# EasyEDA Pro project uicd.eprj, board PCB2
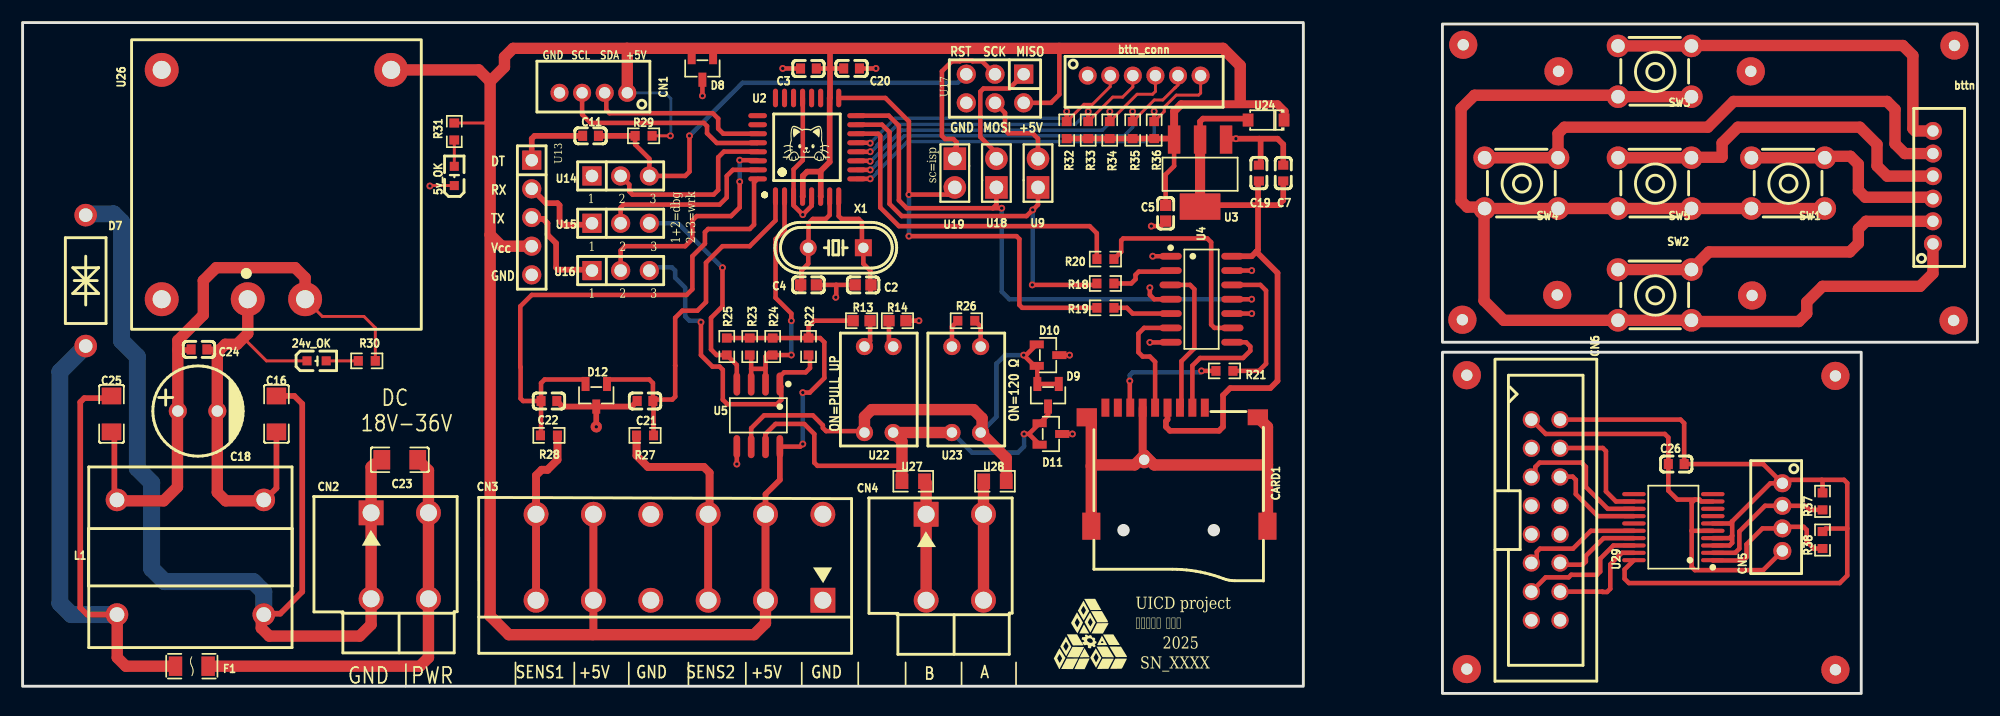
[diagram p3: board, top side]
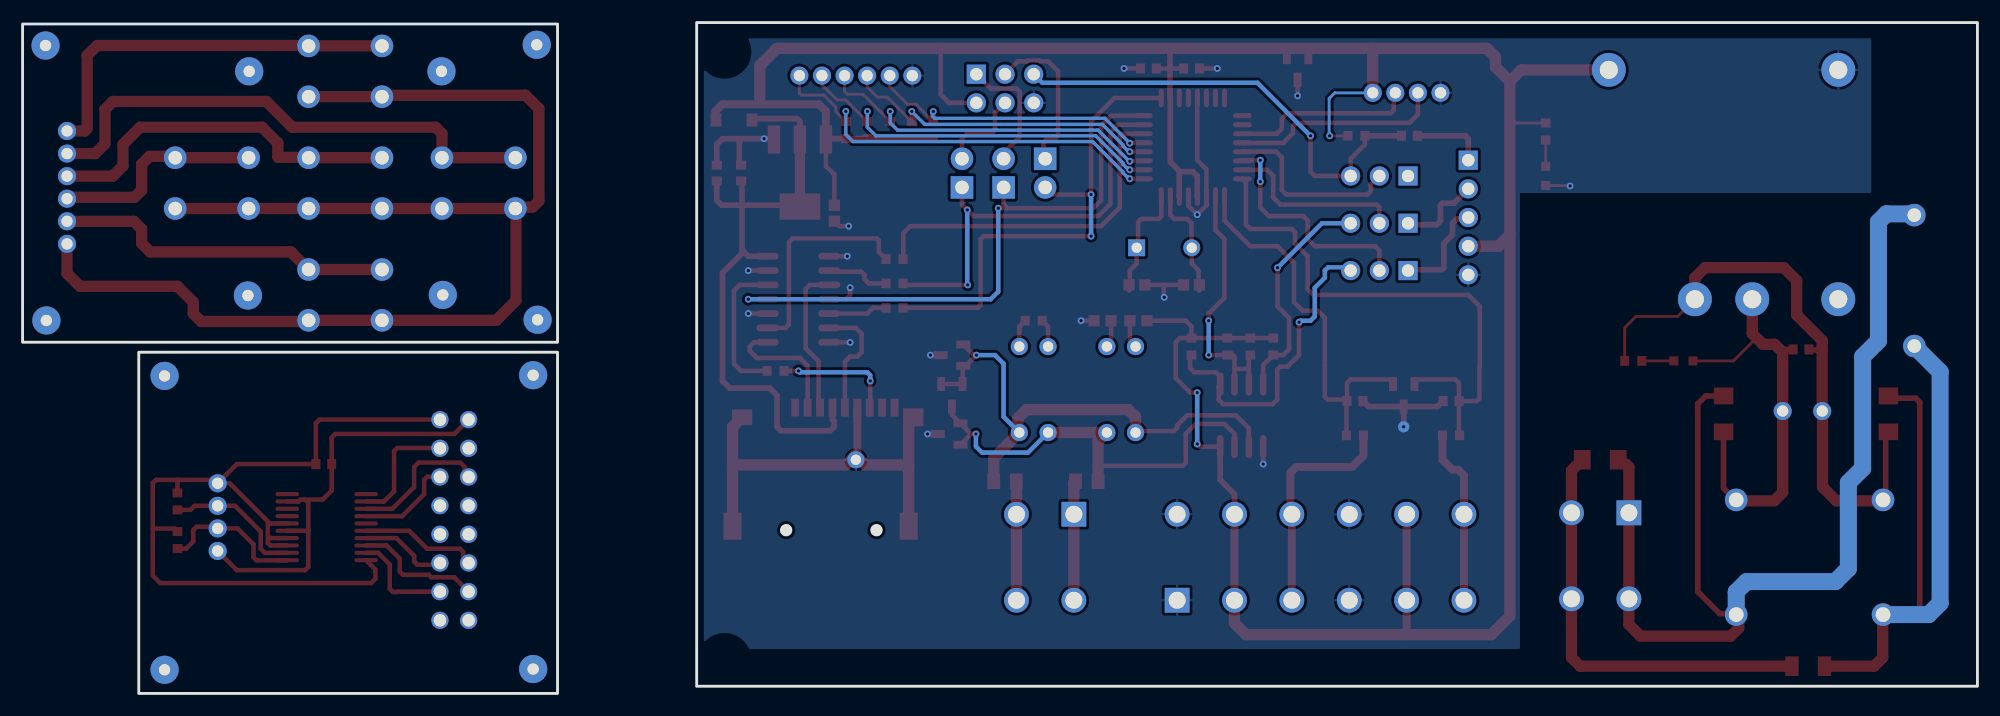
[diagram p4: board, bottom side, seen from below]

Outline 173.1 x 59.44 mm; copper layers: Top Layer, Bottom Layer. Coordinates in mm from the lower left corner of the outline.
Outline path: rectangle 0,59.44 113.41,0.63 ; rectangle 162.81,0 125.73,30.23 ; rectangle 173.1,31.12 125.73,59.31
Stack: Top Layer 0.035mm / Dielectric1 1.51mm FR4 er 4.5 / Bottom Layer 0.035mm

## Design rules (mm)
template: Custom Config
spacing copperThickness1oz (default): track to track 0.102, other pairs 0.152 to 0.3
spacing copperThickness2oz: track to track 0.203, other pairs 0.152 to 0.3
track width copperThickness1oz (default): min 0.127, default 0.4, max 2.54
track width copperThickness2oz: min 0.203, default 0.4, max 2.54
differential pair differentialPair (default): width min 0.127, default 0.254, max 2.54; gap min 0.152, default 0.152
via viaSize (default): diameter min 0.5, default 0.61, max 10; hole min 0.3, default 0.305, max 6.3

## Placement (name value [footprint] x y rotation side)
5v_OK  EL0603/G6C-A01/DT(TS)(GW)  [LED0603-R-RD_GREEN]  38.23 45.85 90 top
24v_OK  EL0603/G6C-A01/DT(TS)(GW)  [LED0603-R-RD_GREEN]  26.04 29.46 0 top
bttn  B6B-PH-K-S(LF)(SN)  [CONN-TH_B6B-PH-K-S]  169.16 44.83 270 top
bttn_conn  B6B-PH-K-S(LF)(SN)  [CONN-TH_B6B-PH-K-S]  99.31 54.74 180 top
C2  22pF  [C0603#2]  74.42 36.2 180 top
C3  100nF  [C0603]  69.59 55.36 0 top
C4  22pF  [C0603#2]  69.6 36.2 0 top
C5  100nF  [C0603#2]  101.22 42.55 90 top
C7  100nF  [C0603]  111.63 46.1 270 top
C11  100nF  [C0603]  50.29 49.4 0 top
C16  1nF  [C1206]  22.48 24.77 90 top
C18  100uF  [CAP-TH_BD8.0-P3.50-D0.5-FD]  15.49 25.02 0 top
C19  10uF  [C0603]  109.47 46.1 90 top
C20  10uF  [C0603]  73.41 55.37 180 top
C21  10nF  [C0603]  55.12 25.91 0 top
C22  10nF  [C0603]  46.61 25.91 180 top
C23  4.7uF  [C1206]  33.4 20.7 0 top
C24  100nF  [C0603]  15.62 30.48 180 top
C25  1nF  [C1206]  7.87 24.77 90 top
C26  100nF  [C0603]  146.43 20.32 0 top
CARD1  TF-15x15  [TF-SMD_TF-15-15]  102.24 20.07 270 top
CN1  B4B-PH-K-S(LF)(SN)  [CONN-TH_B4B-PH-K-S]  50.55 53.21 0 top
CN2  KF142V-5.08-2P  [CONN-TH_P5.08_KF142V-5.08-2P]  33.4 12.19 0 top
CN3  KF142V-5.08-6P  [CONN-TH_6P-P5.08_KF142V-5.08-6P]  58.17 12.07 0 top
CN4  KF142V-5.08-2P  [CONN-TH_P5.08_KF142V-5.08-2P]  82.55 12.07 0 top
CN5  B4B-PH-K-S(LF)(SN)  [CONN-TH_B4B-PH-K-S]  155.83 15.62 90 top
CN6  DS1013-16SSiB1-B-0  [IDC-TH_16P-P2.54_C3406]  134.87 15.37 270 top
D7  P6KE33CA  [DO-15_BD3.1-L6.7-P10.70-D0.9-BI]  5.59 36.58 270 top
D8  PESD5V0S2BT  [SOT-23-3_L2.9-W1.3-P1.90-LS2.4-BR]  60.2 55.37 90 top
D9  PESD5V0S2BT  [SOT-23-3_L2.9-W1.3-P1.90-LS2.4-BR]  90.81 26.42 90 top
D10  PESD5V0S2BT  [SOT-23-3_L2.9-W1.3-P1.90-LS2.4-BR]  90.81 29.97 180 top
D11  PESD5V0S2BT  [SOT-23-3_L2.9-W1.3-P1.90-LS2.4-BR]  91.06 22.99 180 top
D12  PESD5V0S2BT  [SOT-23-3_L2.9-W1.3-P1.90-LS2.4-BR]  50.8 26.42 90 top
F1  1206L200/24NR  [F1206]  14.99 2.41 180 top
L1  PLA10AS1030R7R2B  [FILTER-TH_PLA10AS1030R7R2B]  14.86 12.07 0 top
NOREF  -  [Pad_e684]  171.07 57.4 180 top
NOREF#2  -  [Pad_e732]  153.15 35.26 180 top
NOREF#3  -  [Pad_e731]  135.89 35.31 180 top
NOREF#4  -  [Pad_e899]  127.89 2.16 180 top
NOREF#5  -  [Pad_e733]  153.03 55.12 180 top
NOREF#6  -  [Pad_e737]  136.01 55.12 180 top
NOREF#7  -  [Pad_e900]  160.53 2.1 180 top
NOREF#8  -  [Pad_e716]  170.99 33.04 180 top
NOREF#9  -  [Pad_e898]  127.89 28.19 180 top
NOREF#10  -  [Pad_e552]  99.31 20.7 0 top
NOREF#11  -  [Pad_e687]  127.57 57.47 180 top
NOREF#12  -  [Pad_e720]  127.5 33.11 180 top
NOREF#13  -  [Pad_e906]  160.53 28.13 180 top
R13  560Ω  [R0603#2]  74.3 33.02 0 top
R14  560Ω  [R0603#2]  77.47 33.02 0 top
R18  3.3kΩ  [R0603]  95.89 36.32 0 top
R19  3.3kΩ  [R0603]  95.89 34.16 0 top
R20  3.3kΩ  [R0603]  95.89 38.48 0 top
R21  3.3kΩ  [R0603]  106.43 28.58 180 top
R22  10kΩ  [R0603]  69.6 30.73 90 top
R23  10kΩ  [R0603]  64.39 30.73 90 top
R24  10kΩ  [R0603]  66.42 30.73 90 top
R25  10kΩ  [R0603]  62.36 30.73 90 top
R26  120Ω  [R0603]  83.57 33.02 180 top
R27  10kΩ  [R0603]  55.12 22.86 180 top
R28  10kΩ  [R0603]  46.61 22.86 180 top
R29  10kΩ  [R0603]  54.99 49.4 0 top
R30  10kΩ  [R0603]  30.48 29.46 180 top
R31  4k7  [R0603]  38.23 49.78 270 top
R32  10kΩ  [R0603]  92.46 49.91 270 top
R33  10kΩ  [R0603]  94.36 49.91 270 top
R34  10kΩ  [R0603]  96.27 49.91 270 top
R35  10kΩ  [R0603]  98.3 49.91 270 top
R36  10kΩ  [R0603]  100.2 49.91 270 top
R37  3.3kΩ  [R0603]  159.39 17.02 90 top
R38  3.3kΩ  [R0603]  159.39 13.59 90 top
SW1  1-1825910-4  [KEY-TH_4P-L6.0-W6.0-P4.50-LS7.5]  156.34 45.21 180 top
SW2  1-1825910-4  [KEY-TH_4P-L6.0-W6.0-P4.50-LS7.5]  144.53 35.31 180 top
SW3  1-1825910-4  [KEY-TH_4P-L6.0-W6.0-P4.50-LS7.5]  144.53 55.12 180 top
SW4  1-1825910-4  [KEY-TH_4P-L6.0-W6.0-P4.50-LS7.5]  132.72 45.21 180 top
SW5  1-1825910-4  [KEY-TH_4P-L6.0-W6.0-P4.50-LS7.5]  144.53 45.21 180 top
U2  ATMEGA328-AU  [TQFP-32_L7.0-W7.0-P0.80-LS9.0-BL]  69.47 48.39 0 top
U3  AMS1117-3.3  [SOT-223-3_L6.5-W3.4-P2.30-LS7.0-BR-1]  104.27 46.1 90 top
U4  AIP74HC125  [SOP-14_L8.6-W3.9-P1.27-LS6.0-BL]  104.39 34.93 270 top
U5  MAX485CSA+  [SOIC-8_L4.9-W3.9-P1.27-LS6.0-BL]  65.15 24.64 180 top
U9  DS1021-1x2SF11-B  [HDR-TH_2P-P2.54-V-M]  89.92 46.1 90 top
U13  DS1021-1x5SF11-B  [HDR-TH_5P-P2.54-V-M]  45.09 42.16 270 top
U14  DS1021-1x3SF11-B  [HDR-TH_3P-P2.54-V-M]  52.96 45.85 0 top
U15  DS1021-1x3SF11-B  [HDR-TH_3P-P2.54-V-M]  52.96 41.66 0 top
U16  DS1021-1x3SF11-B  [HDR-TH_3P-P2.54-V-M]  52.96 37.47 0 top
U17  DS1021-2x3SF11-B  [HDR-TH_6P-P2.54-V-M-R2-C3-S2.54]  86.11 53.59 180 top
U18  DS1021-1x2SF11-B  [HDR-TH_2P-P2.54-V-M]  86.23 46.1 90 top
U19  DS1021-1x2SF11-B  [HDR-TH_2P-P2.54-V-M]  82.55 46.1 270 top
U22  SMQS-02R-TP  [SW-TH_4P-L9.9-W6.8-P7.62-BL]  75.82 26.92 180 top
U23  SMQS-02R-TP  [SW-TH_4P-L9.9-W6.8-P7.62-BL]  83.57 26.92 0 top
U24  BAT46W  [SOD-123_L2.8-W1.6-LS3.7-RD]  110.11 50.8 180 top
U26  URB2405YMD-10WR3  [PWRM-TH_HI-LINK_URXXYMD-XXWR3]  22.48 45.09 90 top
U27  0805L050WR  [R0805]  78.87 18.8 0 top
U28  0805L050WR  [R0805]  86.11 18.8 180 top
U29  MCP23008-E/SS  [SSOP-20_L7.2-W5.3-P0.65-LS7.8-BL]  146.18 14.73 90 top
X1  20MHz  [HC-49US_L11.5-W4.5-P4.88]  72.01 39.49 180 top

## Footprints (pads in the part's own frame, mm; a bottom-side part is the same pattern mirrored in y, then rotated)
C0603
  rect 0.8x0.9 smd: 1(-0.7,0) 2(0.7,0)
C0603#2
  rect 1x1 smd: 1(-0.7,0) 2(0.7,0)
C1206
  rect 1.485x1.728 smd: 1(-1.593,0) 2(1.593,0)
CAP-TH_BD8.0-P3.50-D0.5-FD
  round 1.6 hole 1: 1(-1.75,0) 2(1.75,0)
CONN-TH_6P-P5.08_KF142V-5.08-6P
  round 2.2 hole 1.5: 1(12.7,3.81) 2(7.62,3.81) 2(7.62,-3.81) 3(2.54,3.81) 3(2.54,-3.81) 4(-2.54,3.796) 4(-2.54,-3.81) 5(-7.62,3.81) 5(-7.62,-3.81) 6(-12.7,3.81) 6(-12.7,-3.81)
  rect 2.2x2.2 hole 1.5: 1(12.7,-3.81)
CONN-TH_B4B-PH-K-S
  round 1.6 hole 1: 1(3,0) 2(1,0) 3(-1,0) 4(-3,0)
CONN-TH_B6B-PH-K-S
  round 1.6 hole 1: 1(5,0) 2(3,0) 3(1,0) 4(-1,0) 5(-3,0) 6(-5,0)
CONN-TH_P5.08_KF142V-5.08-2P
  rect 2.2x2.2 hole 1.5: 1(-2.54,3.81)
  round 2.2 hole 1.5: 1(-2.54,-3.81) 2(2.54,3.81) 2(2.54,-3.81)
DO-15_BD3.1-L6.7-P10.70-D0.9-BI
  round 2 hole 1.2: 1(-5.8,0) 2(5.8,0)
F1206
  rect 1.19x1.728 smd: 1(-1.445,0) 2(1.445,0)
FILTER-TH_PLA10AS1030R7R2B
  round 2 hole 1.3: 1(-6.5,-5.08) 2(-6.5,5.08) 3(6.5,5.08) 4(6.5,-5.08)
HC-49US_L11.5-W4.5-P4.88
  rect 1.5x1.5 hole 0.9: 1(-2.44,0)
  round 1.5 hole 0.9: 2(2.44,0)
HDR-TH_2P-P2.54-V-M
  rect 2x2 hole 1.2: 1(-1.27,0)
  round 2 hole 1.2: 2(1.27,0)
HDR-TH_3P-P2.54-V-M
  rect 1.7x1.7 hole 1.1: 1(-2.54,0)
  round 1.7 hole 1.1: 2(0,0) 3(2.54,0)
HDR-TH_5P-P2.54-V-M
  rect 1.7x1.7 hole 1.1: 1(-5.08,0)
  round 1.7 hole 1.1: 2(-2.54,0) 3(0,0) 4(2.54,0) 5(5.08,0)
HDR-TH_6P-P2.54-V-M-R2-C3-S2.54
  rect 1.7x1.7 hole 1.1: 1(-2.54,-1.27)
  round 1.7 hole 1.1: 2(-2.54,1.27) 3(0,-1.27) 4(0,1.27) 5(2.54,-1.27) 6(2.54,1.27)
IDC-TH_16P-P2.54_C3406
  round 1.524 hole 1.1: 1(-8.89,-1.27) 2(-8.89,1.27) 3(-6.35,-1.27) 4(-6.35,1.27) 5(-3.81,-1.27) 6(-3.81,1.27) 7(-1.27,-1.27) 8(-1.27,1.27) 9(1.27,-1.27) 10(1.27,1.27) 11(3.81,-1.27) 12(3.81,1.27) 13(6.35,-1.27) 14(6.35,1.27) 15(8.89,-1.27) 16(8.89,1.27)
KEY-TH_4P-L6.0-W6.0-P4.50-LS7.5
  round 2 hole 1.2: 1(-3.25,-2.25) 2(3.25,-2.25) 3(3.25,2.25) 4(-3.25,2.25)
LED0603-R-RD_GREEN
  rect 0.8x0.8 smd: 1(0.851,0) 2(-0.851,0)
Pad_e552
  round 1.524 hole 0.914: 1(0,0)
Pad_e684
  round 2.5 hole 1: 1(0,0)
Pad_e687
  round 2.5 hole 1: 1(0,0)
Pad_e716
  round 2.5 hole 1: 1(0,0)
Pad_e720
  round 2.5 hole 1: 1(0,0)
Pad_e731
  round 2.5 hole 1: 1(0,0)
Pad_e732
  round 2.5 hole 1: 1(0,0)
Pad_e733
  round 2.5 hole 1: 1(0,0)
Pad_e737
  round 2.5 hole 1: 1(0,0)
Pad_e898
  round 2.5 hole 1: 1(0,0)
Pad_e899
  round 2.5 hole 1: 1(0,0)
Pad_e900
  round 2.5 hole 1: 1(0,0)
Pad_e906
  round 2.5 hole 1: 1(0,0)
PWRM-TH_HI-LINK_URXXYMD-XXWR3
  round 3 hole 1.6: 1(-10.16,2.54) 2(-10.16,-2.54) 3(10.16,-10.16) 5(10.16,10.16) 6(-10.16,10.16)
R0603
  rect 0.806x0.864 smd: 1(-0.753,0) 2(0.753,0)
R0603#2
  rect 1x1 smd: 1(-0.753,0) 2(0.753,0)
R0805
  rect 1.133x1.377 smd: 1(-1,0) 2(1,0)
SOD-123_L2.8-W1.6-LS3.7-RD
  rect 0.95x1.15 smd: 1(-1.593,0) 2(1.593,0)
SOIC-8_L4.9-W3.9-P1.27-LS6.0-BL
  oval 0.588x2.045 smd: 1(-1.905,-2.772) 2(-0.635,-2.772) 3(0.635,-2.772) 4(1.905,-2.772) 5(1.905,2.772) 6(0.635,2.772) 7(-0.635,2.772) 8(-1.905,2.772)
SOP-14_L8.6-W3.9-P1.27-LS6.0-BL
  oval 0.595x1.968 smd: 1(-3.81,-2.734) 2(-2.54,-2.734) 3(-1.27,-2.734) 4(0,-2.734) 5(1.27,-2.734) 6(2.54,-2.734) 7(3.81,-2.734) 8(3.81,2.734) 9(2.54,2.734) 10(1.27,2.734) 11(0,2.734) 12(-1.27,2.734) 13(-2.54,2.734) 14(-3.81,2.734)
SOT-23-3_L2.9-W1.3-P1.90-LS2.4-BR
  rect 1.25x0.7 smd: 1(1,-0.95) 2(1,0.95) 3(-1,0)
SOT-223-3_L6.5-W3.4-P2.30-LS7.0-BR-1
  rect 2.5x1.1 smd: 1(2.97,-2.3) 2(2.97,0) 3(2.97,2.3)
  rect 2.34x3.6 smd: 2(-2.97,0)
SSOP-20_L7.2-W5.3-P0.65-LS7.8-BL
  oval 0.364x2.082 smd: 1(-2.925,-3.491) 2(-2.275,-3.491) 3(-1.625,-3.491) 4(-0.975,-3.491) 5(-0.325,-3.491) 6(0.325,-3.491) 7(0.975,-3.491) 8(1.625,-3.491) 9(2.275,-3.491) 10(2.925,-3.491) 11(2.925,3.491) 12(2.275,3.491) 13(1.625,3.491) 14(0.975,3.491) 15(0.325,3.491) 16(-0.325,3.491) 17(-0.975,3.491) 18(-1.625,3.491) 19(-2.275,3.491) 20(-2.925,3.491)
SW-TH_4P-L9.9-W6.8-P7.62-BL
  round 1.524 hole 0.914: 1(-1.27,-3.81) 2(1.27,-3.81) 3(1.27,3.81) 4(-1.27,3.81)
TF-SMD_TF-15-15
  rect 1.6x0.701 smd: 1(-5.252,2.45) 2(-5.252,1.35) 3(-5.252,0.25) 4(-5.252,-0.85) 5(-5.252,-1.95) 6(-5.252,-3.05) 7(-5.252,-4.15) 8(-5.252,-5.25) 9(-5.252,-6.35)
  rect 1.6x1.8 smd: 10(-4.399,-8)
  rect 2.4x1.6 smd: 11(5.252,-7.6) 12(5.252,8)
  rect 1.399x1.801 smd: 13(-4.398,7.151)
TQFP-32_L7.0-W7.0-P0.80-LS9.0-BL
  oval 0.45x1.65 smd: 1(-2.8,-4.369) 2(-2,-4.369) 3(-1.2,-4.369) 4(-0.4,-4.369) 5(0.4,-4.369) 6(1.2,-4.369) 7(2,-4.369) 8(2.8,-4.369) 17(2.8,4.369) 18(2,4.369) 19(1.2,4.369) 20(0.4,4.369) 21(-0.4,4.369) 22(-1.2,4.369) 23(-2,4.369) 24(-2.8,4.369)
  oval 1.65x0.45 smd: 9(4.381,-2.8) 10(4.381,-2) 11(4.381,-1.2) 12(4.381,-0.4) 13(4.381,0.4) 14(4.381,1.2) 15(4.381,2) 16(4.381,2.8) 25(-4.381,2.8) 26(-4.381,2) 27(-4.381,1.2) 28(-4.381,0.4) 29(-4.381,-0.4) 30(-4.381,-1.2) 31(-4.381,-2) 32(-4.381,-2.8)

## Nets
As in the schematic, except:
GND: 5v_OK.2 bttn_conn.1 C2.2 C3.1 C4.2 C5.1 C7.1 C19.2 C20.1 C21.1 C22.1 CARD1.6 CARD1.10 CARD1.11 CARD1.12 CARD1.13 CN1.4 CN3.1 CN3.4 D8.3 D10.3 D11.3 D12.3 NOREF#10.1 R14.2 U2.3 U2.5 U2.21 U3.1 U4.1 U4.4 U4.7 U4.10 U4.13 U5.5 U13.5 U17.6 U26.5
$1N10247: C25.2 D7.2 F1.2 L1.1

Pads without a net: CARD1 1 8 9; CN6 3 7 8 9 10 15 16; NOREF 1; NOREF#2 1; NOREF#3 1; NOREF#4 1; NOREF#5 1; NOREF#6 1; NOREF#7 1; NOREF#8 1; NOREF#9 1; NOREF#11 1; NOREF#12 1; NOREF#13 1; U2 19 20 22 23 24 25 26; U14 1; U26 6; U29 7 8 10 11 15

## Via types
v1: diameter 0.61, hole 0.305, Top Layer to Bottom Layer, 47 vias
v2: diameter 1, hole 0.305, Top Layer to Bottom Layer, 1 via

## Routing (per net, layer and track width the routed paths; a pad name or vN(x,y) marks a point on that pad's centre or on a via; arc(x,y) is an arc through that point)
+5V: length 283
  Top Layer w0.254: 41.15,50.8 40.89,50.54 R31.1 ; R29.2 v1(57.36,49.4)
  Top Layer w0.4: U5.8 68.86,21.87 v1(69.09,22.1) ; C5.2 101.22,45.97 101.97,46.72 101.97,49.07 ; R22.2 R24.2 R23.2 R25.2 ; R22.2 70.62,31.49 70.99,31.12 70.99,27.94 69.7,26.65 v1(69.09,26.65) ; R22.2 69.6,32.51 70.1,33.02 R13.1 ; C3.2 72.7,55.36 C20.2 ; U17.2 91.06,52.32 91.8,53.07 91.8,57.15
  Top Layer w0.5: R32.2 R33.2 R34.2 R35.2 R36.2 101.88,49.16 101.97,49.07 ; 70.68,46.29 70.68,44.02 U2.6 ; 70.68,46.29 71.47,47.09 U2.18 71.5,52.79 71.5,56.77 ; 70.68,46.29 70.61,46.23 69.47,46.23 69.09,45.85 69.09,44.04 U2.4 ; U5.8 67.06,18.92 65.79,17.65 CN3.2
  Top Layer w0.7: CN3.5 CN3.5 50.55,5.26 50.49,5.21 ; CN3.2 CN3.2 ; U24.1 111.76,50.86 111.76,51.57 111.13,52.2 102.59,52.2 101.97,51.57 101.97,49.07
  Top Layer w1: 53.52,57.15 53.55,57.12 CN1.1 ; 53.52,57.15 43.43,57.15 42.67,56.39 42.67,55.5 41.4,54.23 ; 53.52,57.15 106.3,57.15 107.82,55.63 107.82,52.58 ; 41.4,40.64 41.4,54.23 ; 41.4,40.64 41.4,6.86 43.05,5.21 64.77,5.21 65.79,6.22 CN3.2 ; 41.4,40.64 42.42,39.62 U13.4 ; 41.4,54.23 40.39,55.25 32.64,55.25
  Bottom Layer w0.254: CN1.1 56.9,53.21 57.4,52.7 57.4,49.44 v1(57.36,49.4)
  Bottom Layer w0.4: v1(69.09,22.1) v1(69.09,26.65)
GND: length 98.8
  Top Layer w0.254: 5v_OK.2 36.11,45 v1(36.07,44.96)
  Top Layer w0.4: v1(99.82,31.1) 101.61,31.1 101.62,31.12 ; C4.2 72.05,36.2 ; 72.05,36.2 C2.2 ; 72.05,36.2 72.05,35.14 v1(72.01,35.1) ; v1(63.25,20.32) 63.25,21.96 ; v1(108.84,33.66) 107.16,33.66 ; C3.1 68.88,55.37 v1(67.31,55.37) ; C5.1 100.78,41.4 v1(99.95,41.4) ; R14.2 v1(79.38,33.02) ; 101.62,34.93 100.2,34.93 99.82,35.31 v1(99.82,35.94) ; D10.3 v1(92.71,29.97) ; v1(92.96,22.99) D11.3 ; v1(108.84,37.47) 107.16,37.47 ; v1(60.2,52.95) D8.3 ; U2.5 69.87,43.2 v1(69.09,42.42) 68.27,43.24 U2.3 68.27,46.43 69.09,47.24 69.09,52.74 U2.21 ; C20.1 v1(75.57,55.37) ; v1(100.08,38.73) 101.62,38.73
  Top Layer w0.5: C7.1 111.63,48.64 111.12,49.15 109.5,49.15 ; C22.1 47.8,25.42 D12.3 ; v2(50.8,23.62) D12.3 ; D12.3 53.93,25.42 C21.1 ; 109.5,49.15 109.63,49.02 109.63,46.96 C19.2 109.6,46.8 ; 109.5,49.15 v1(107.44,49.15) 106.65,49.15 U3.1 106.62,49.02
  Top Layer w0.7: CARD1.6 99.19,21.27
  Top Layer w1: CARD1.10 94.64,24.06 94.64,20.14 ; CARD1.13 110.24,23.61 110.24,20.24 ; 94.64,20.14 94.74,20.25 98.48,20.25 99.34,21.11 100.21,20.24 110.24,20.24 ; 94.64,20.14 CARD1.11 ; 110.24,20.24 CARD1.12
DO: length 20.4
  Top Layer w0.4: 63.25,27.32 63.25,29.09 R25.1 61.46,29.98 60.96,30.48 60.96,33.27 61.98,34.29 v1(61.98,37.72)
  Bottom Layer w0.4: v1(61.98,37.72) 58.04,41.66 U15.3
MISO: length 53.6
  Top Layer w0.4: U18.1 86.23,43.31 85.92,42.99 ; v1(108.84,34.93) 107.16,34.93 ; 85.92,42.99 v1(86.7,42.99) ; 85.92,42.99 78.3,42.99 77.6,43.69 77.6,50.29 76.7,51.19 U2.16
  Bottom Layer w0.4: v1(108.84,34.93) 87.38,34.93 86.7,35.6 v1(86.7,42.99)
MOSI: length 37.5
  Top Layer w0.4: v1(89.41,36.2) 95,36.2 R18.1 ; U9.1 89.92,43.31 v1(89.45,42.84) 88.9,42.29 77.85,42.29 76.77,43.37 76.77,49.72 76.11,50.39 U2.15
  Bottom Layer w0.4: v1(89.41,36.2) 89.45,36.23 v1(89.45,42.84)
RE/DE: length 23.7
  Top Layer w0.4: 65.79,27.32 65.79,28.83 ; 65.79,28.83 65.71,28.75 64.52,28.75 ; 65.79,28.83 65.79,29.84 66.07,30.13 66.12,30.08 ; 66.42,30.08 66.52,30.08 ; 64.52,27.32 64.52,28.75 ; 64.52,28.75 64.52,29.85 R23.1 ; U2.2 67.47,41.05 66.68,40.26 66.68,35.05 68.07,33.66 v1(68.07,33.02) ; R24.1 68.07,29.98
  Bottom Layer w0.4: v1(68.07,33.02) v1(68.07,29.98)
RO: length 28.4
  Top Layer w0.4: R22.1 69.72,29.85 69.72,28.83 69.34,28.45 67.44,28.45 67.06,28.07 67.06,27.32 67.18,27.19 67.18,26.01 66.8,25.62 62.41,25.62 62.01,26.03 62.01,28.67 61.72,28.96 61.09,28.96 60.07,29.97 v1(60.07,32.89)
  Bottom Layer w0.4: U16.3 55.78,37.75 57.5,37.75 57.79,37.47 57.79,36.83 58.67,35.94 58.67,33.4 59.06,33.02 59.94,33.02 v1(60.07,32.89)
RST: length 41
  Top Layer w0.4: v1(59.06,49.4) 59.06,46.23 58.67,45.85 U14.3 55.5,47.37 54.24,48.63 R29.1
  Top Layer w0.5: C11.2 R29.1
  Bottom Layer w0.4: U17.5 82.8,54.1 63.75,54.1 v1(59.06,49.4)
SC: length 30.9
  Top Layer w0.4: R20.1 95.12,38.49 95.12,40.77 94.49,41.4 77.6,41.4 75.95,43.05 75.95,49.4 75.76,49.59 U2.14
SCK: length 44.3
  Top Layer w0.4: U19.2 81.91,44.2 v1(78.49,44.2) 78.49,50.67 76.4,52.76 U2.17 ; v1(78.49,40.51) 88.01,40.51 88.27,40.26 88.27,34.42 88.52,34.16 R19.1
  Bottom Layer w0.4: v1(78.49,40.51) v1(78.49,44.2)
$1N1: length 10.1
  Top Layer w0.4: 68.9,35.69 68.96,35.75 68.96,37.47 69.57,38.07 X1.2 69.6,39.51 69.6,41.66 69.98,42.04 71.12,42.04 71.47,42.39 U2.7
$1N2: length 10.4
  Top Layer w0.4: 75.12,35.69 75.06,35.75 75.06,37.47 74.45,38.07 X1.1 74.32,39.61 74.32,41.75 74.04,42.04 72.52,42.04 72.27,42.29 U2.8
$1N5: length 20.7
  Top Layer w0.4: U2.30 65.03,47.24 v1(63.5,47.24) ; v1(63.5,45.34) 63.5,43.05 62.74,42.29 59.69,42.29 59.31,41.91 59.31,40.26 58.67,39.62 53.34,39.62 52.96,39.24 U16.2
  Bottom Layer w0.4: v1(63.5,47.24) v1(63.5,45.34)
$1N14: length 9.1
  Top Layer w0.5: 50.42,37.47 49.91,37.47 49.84,37.54 47.42,37.54 47.24,37.72 47.24,39.88 46.48,40.64 46.48,41.66 46.1,42.04 45.21,42.04 U13.3
$1N15: length 7.5
  Top Layer w0.5: 50.42,41.66 50.29,41.53 47.88,41.53 47.55,41.86 47.55,43.25 47.37,43.43 46.36,43.43 U13.2
$1N22: length 16.5
  Top Layer w0.4: U14.2 53.72,45.09 53.72,44.48 54,44.2 61.2,44.2 61.59,44.6 61.59,47.5 62.1,48.01 65.07,48.01 U2.29
$1N25: length 7.8
  Top Layer w0.4: U9.2 89.92,49.15 89.44,49.63 87.28,49.63 87,49.91 87,51.44 U17.4
$1N27: length 11
  Top Layer w0.4: U18.2 86.23,47.88 84.81,49.31 84.81,53.31 85.09,53.59 87.38,53.59 U17.1
$1N28: length 14.4
  Top Layer w0.4: U17.3 84.96,56.01 84.12,56.01 84.06,56.07 83.07,56.07 83.01,56.01 82.3,56.01 81.41,55.12 81.41,49.4 81.69,49.12 82.42,49.12 82.71,48.84 82.71,48.44 82.55,48.28 U19.1
$1N40: length 34.6
  Top Layer w0.4: C21.2 55.95,26.04 57.53,26.04 57.79,26.29 57.79,29.03 57.79,29.03 57.79,33.27 58.42,33.91 59.75,33.91 60.52,34.67 60.52,38.16 61.98,39.62 64.39,39.62 66.67,41.9 U2.1 ; C21.2 55.82,27.49 55.5,27.81 51.77,27.81 51.75,27.83 ; C21.2 55.87,25.85 R27.1
$1N1591: length 20.2
  Top Layer w0.7: R27.2 54.36,21.07 55.37,20.07 60.33,20.07 60.83,19.56 60.83,16 CN3.3 CN3.3
$1N2127: length 18.9
  Top Layer w0.4: U2.28 65.07,48.77 61.47,48.77 60.61,49.63 60.61,50.26 60.33,50.55 50.29,50.55 49.55,51.29 CN1.3
$1N2135: length 16.4
  Top Layer w0.4: CN1.2 51.69,53.07 51.69,51.69 51.97,51.41 61.12,51.41 61.59,50.93 61.59,50.04 62.05,49.59 U2.27
$1N8792: length 37.1
  Top Layer w0.254: 24v_OK.2 21.59,29.46 19.81,31.24
  Top Layer w0.5: C24.1 17.5,30.48 ; 21.36,17.07 22.48,18.19 C16.1
  Top Layer w1: 19.94,34.93 19.94,31.88 19,30.93 17.95,30.93 17.5,30.48 17.24,30.23 C18.2 17.24,17.81 17.99,17.07 21.36,17.07
$1N9139: length 15.7
  Top Layer w0.7: R28.1 47.36,20.69 46.48,19.81 45.96,19.81 45.47,19.32 CN3.6 CN3.6
$1N10226: length 37.7
  Top Layer w1: 16.43,2.41 35.18,2.41 35.94,3.18 35.94,19.75 C23.2
$1N10247: length 63.6
  Top Layer w0.5: 8.36,7.06 8.28,6.99 5.72,6.99 5.11,7.59 5.11,25.81 5.46,26.16 7.81,26.16 8.13,26.48
  Top Layer w1: 8.36,7.06 8.38,7.04 8.38,3.18 9.14,2.41 F1.2
  Bottom Layer w1.5: D7.2 3.3,28.49 3.3,8 4.32,6.99 L1.1
$1N10427: length 54.6
  Top Layer w0.254: R30.1 31.23,32.39 30.23,33.4 26.54,33.4 U26.2
  Top Layer w0.5: 13.74,30.43 14.87,30.43 C24.2 ; 8.36,17.07 8.13,17.3 8.13,23.3
  Top Layer w1: U26.2 25.02,36.83 24.13,37.72 17.15,37.72 16,36.58 16,33.53 13.74,31.27 C18.1 13.72,24.99 13.72,18.29 12.49,17.07 8.36,17.07
$1N12126: length 2.3
  Top Layer w0.254: R31.2 5v_OK.1
$1N12155: length 97.7
  Top Layer w0.5: C16.2 24.06,26.36 24.77,25.65 24.77,9.02 22.81,7.06 21.36,7.06
  Top Layer w1: 31.12,20.32 30.86,20.07 CN2.1 CN2.1 30.86,6.1 29.84,5.08 21.84,5.08 21.14,5.79 21.14,6.84 21.36,7.06
  Bottom Layer w1.5: L1.4 21.36,8.99 20.45,9.91 12.57,9.91 11.43,11.05 11.43,18.67 10.16,19.94 10.16,29.84 8.76,31.24 8.76,41.78 8.06,42.49 5.7,42.49 D7.1
$1N12202: length 2.8
  Top Layer w0.254: 24v_OK.1 R30.2
$1N17737: length 49
  Top Layer w0.4: C22.2 45.91,27.49 46.23,27.81 49.83,27.81 49.85,27.83 ; C22.2 45.91,22.91 R28.2 ; C22.2 44.32,25.91 44.1,26.13 44.1,28.9 44.07,28.93 44.07,34.29 45.09,35.31 58.8,35.31 59.31,35.81 59.31,38.73 60.42,39.85 60.42,40.87 60.71,41.15 64.39,41.15 64.77,41.53 64.77,45.27 U2.32
$1N17752: length 16
  Top Layer w0.4: U15.2 52.96,43.05 53.21,43.31 61.72,43.31 62.36,43.94 62.36,45.85 62.9,46.39 U2.31
$1N20626: length 27.1
  Top Layer w0.254: R32.1 93.99,52.2 94.74,52.2 96.31,53.77 bttn_conn.2
  Top Layer w0.4: U2.13 75.02,48.79 v1(75.06,48.75) ; R32.1 v1(92.46,51.56)
  Bottom Layer w0.3: v1(92.46,51.56) 92.54,51.48 92.54,51.17 92.33,50.95 77.26,50.95 v1(75.06,48.75)
$1N20631: length 37.9
  Top Layer w0.254: bttn_conn.6 104.32,54.73 104.32,53.19 104.14,53.01 102.16,53.01 101.09,51.94 101.09,51.55 R36.1
  Top Layer w0.4: U2.9 75.05,45.59 v1(75.06,45.59) ; R36.1 v1(100.2,51.57)
  Bottom Layer w0.3: v1(100.2,51.57) 100.2,49.53 99.57,48.9 78.36,48.9 75.66,46.2 75.66,46.13 75.31,45.78 75.24,45.78 v1(75.06,45.59)
$1N20634: length 34.6
  Top Layer w0.254: bttn_conn.5 102.31,53.91 102.06,53.65 102.04,53.65 100.97,52.58 100.21,52.58 R35.1
  Top Layer w0.4: U2.10 75.05,46.39 v1(75.06,46.38) ; v1(98.29,51.56) 98.3,51.55 R35.1
  Bottom Layer w0.3: v1(98.29,51.56) 98.3,51.55 98.3,50.17 97.54,49.4 78.08,49.4 75.66,46.99 75.66,46.89 75.31,46.54 75.21,46.54 v1(75.06,46.38)
$1N20640: length 29.2
  Top Layer w0.254: R33.1 96.53,52.83 97.41,52.83 98.31,53.74 bttn_conn.3
  Top Layer w0.4: R33.1 v1(94.36,51.56) ; U2.12 75.05,47.99 v1(75.06,47.99)
  Bottom Layer w0.3: v1(75.06,47.99) 75.21,48.15 75.31,48.15 75.66,48.5 75.66,48.6 77.49,50.42 93.22,50.42 v1(94.36,51.56)
$1N20643: length 32.3
  Top Layer w0.254: R34.1 98.69,53.09 100.06,53.09 100.31,53.34 bttn_conn.4
  Top Layer w0.4: v1(96.27,51.56) 96.27,51.55 R34.1 ; U2.11 75.02,47.19 v1(75.06,47.15)
  Bottom Layer w0.3: v1(75.06,47.15) 75.1,47.15 77.87,49.91 95.63,49.91 96.27,50.55 v1(96.27,51.56)
$1N25525: length 19
  Top Layer w1: bttn.3 169.04,43.96 163.18,43.96 162.56,44.58 162.56,46.88 161.85,47.59 159.71,47.59 SW1.1 SW1.2
$1N25532: length 32.6
  Top Layer w1: SW5.1 147.81,47.5 150.46,47.5 150.5,47.53 150.5,48.77 151.89,50.17 162.69,50.17 164.21,48.64 164.21,46.74 165.12,45.83 bttn.4 ; SW5.2 147.66,47.46 147.66,47.35
$1N25711: length 115.3
  Top Layer w1: SW3.4 SW3.3 141.15,53 128.56,53 127.38,51.82 127.38,43.63 127.92,43.09 129.34,43.09 SW4.3 ; bttn.1 169.16,37.21 168.02,36.07 159.39,36.07 157.99,34.67 157.99,33.66 157.28,32.95 147.88,32.95 SW2.4 SW2.3 131.16,33.06 129.41,34.8 129.41,42.91 SW4.3 ; SW4.3 SW4.4 SW5.3 SW5.4 SW1.3 SW1.4
$1N25891: length 46.7
  Top Layer w1: bttn.5 166.67,47.83 165.81,48.7 165.81,51.74 165.1,52.45 151.51,52.45 149.22,50.17 136.53,50.17 135.97,49.61 SW4.1 SW4.2
$1N25977: length 34.8
  Top Layer w1: bttn.6 167.59,49.83 167.39,50.04 167.39,56.52 166.5,57.4 147.81,57.4 SW3.1 SW3.2
$1N26054: length 30.4
  Top Layer w1: bttn.2 163.24,41.83 162.56,41.15 162.56,39.88 161.8,39.12 149.34,39.12 SW2.1 ; SW2.2 147.72,37.56 147.72,37.5
$2N1: length 57.9
  Top Layer w0.5: 103.63,43.26 109.4,43.26 ; 109.24,39.14 108.84,38.73 107.16,38.73 ; 109.24,39.14 109.4,39.3 109.4,43.26 ; 109.24,39.14 111.12,37.26 111.12,27.69 110.49,27.05 106.93,27.05 106.3,26.42 106.3,23.62 105.95,23.27 101.6,23.27 101.25,23.62 101.25,24.12 101.39,24.26 CARD1.4 ; U24.2 108.39,50.93 104.52,50.93 104.27,50.67 U3.2 ; 109.4,43.26 111.2,43.26 111.63,43.69 C7.2 ; 109.4,43.26 109.4,45.35 109.35,45.4
  Top Layer w0.9: U3.2 U3.2
$2N9: length 13.3
  Top Layer w0.4: CARD1.3 102.62,25.45 102.62,29.44 103.76,30.58 103.76,35.81 103.38,36.2 U4.3
$2N10: length 10.6
  Top Layer w0.4: U4.6 99.31,32.39 98.81,31.88 98.81,30.23 99.19,29.84 99.82,29.84 100.28,29.38 100.28,25.32
$2N11: length 11.5
  Top Layer w0.4: CARD1.2 103.59,29.04 104.27,29.72 108.08,29.72 108.71,30.35 108.71,30.73 108.33,31.12 U4.8
$2N12: length 10.7
  Top Layer w0.4: CARD1.7 98.04,25.36 v1(98.04,27.69) ; R21.2 v1(104.39,28.58)
  Bottom Layer w0.4: v1(98.04,27.69) 98.04,28.19 98.3,28.45 104.27,28.45 v1(104.39,28.58)
$2N13: length 12.8
  Top Layer w0.4: R21.1 109.47,28.58 110.11,29.21 110.11,35.69 109.6,36.2 107.16,36.2
$2N14: length 5.2
  Top Layer w0.4: R19.2 97.79,34.16 98.3,33.66 101.62,33.66
$2N15: length 5.7
  Top Layer w0.4: 101.62,37.47 101.53,37.37 98.84,37.37 98.55,37.08 98.55,36.7 98.17,36.32 R18.2
$2N17: length 19.4
  Top Layer w0.4: 107.16,32.39 105.54,32.39 105.25,32.68 105.25,39.97 104.9,40.31 97.46,40.31 97.28,40.13 97.28,39.12 R20.2
$3N912: length 2.5
  Top Layer w0.4: U23.4 82.3,32.5 R26.2
$3N917: length 2.5
  Top Layer w0.4: R26.1 84.84,32.5 U23.3
$3N985: length 2.5
  Top Layer w0.4: R13.2 75.05,31.23 U22.2
$3N991: length 2.4
  Top Layer w0.4: 77.09,30.73 76.72,31.11 R14.1
$3N4293: length 39.8
  Top Layer w0.4: 89.11,22.99 D11.1 90.81,24.68 D9.3 ; 89.11,22.99 D11.2 ; 89.11,22.99 v1(88.68,22.99) ; U5.7 65.79,22.99 66.68,23.88 69.22,23.88 70.1,22.99 70.1,20.45 70.39,20.16 77.81,20.16 77.87,20.11
  Top Layer w1: U23.1 77.09,23.11 77.87,22.34 U27.1
  Bottom Layer w0.4: v1(88.68,22.99) 88.68,21.88 88.14,21.34 84.07,21.34 U23.1
$3N4296: length 10.6
  Top Layer w1: U27.2 80.01,18.65 CN4.1 CN4.1
$3N4312: length 47.9
  Top Layer w0.4: U5.6 64.52,23.5 65.66,24.64 69.98,24.64 70.87,23.75 70.87,23.52 71.15,23.24 74.42,23.24 U22.3 ; D10.1 88.86,29.97 v1(88.65,29.97) 89.6,29.02 D10.2 89.86,28.97 D9.2 D9.1
  Top Layer w1: U22.3 74.55,24.51 75.18,25.15 84.2,25.15 84.96,24.38 84.96,23.24 U23.2 87.11,20.84 U28.1
  Bottom Layer w0.4: v1(88.65,29.97) 87,29.97 86.23,29.21 86.23,24.51 U23.2
$3N4779: length 10.2
  Top Layer w1: CN4.2 CN4.2 85.09,18.43
$3N6044: length 13
  Top Layer w0.4: R38.1 158.61,12.84 157.99,13.46 157.99,14.48 157.71,14.76 155.97,14.76 CN5.3 154.07,14.62 152.65,13.21 152.65,12.07 152.37,11.78 149.69,11.78 U29.1
$3N6050: length 12.5
  Top Layer w0.4: R37.1 158.23,16.26 157.88,16.62 CN5.2 154.29,16.62 152.02,14.35 152.02,12.83 151.65,12.46 U29.2
$3N6057: length 38.6
  Top Layer w0.4: CN5.4 154.13,10.92 148.08,10.92 147.8,11.21 147.8,14.42 ; U29.5 147.81,14.41 147.8,14.42 ; 147.8,14.42 147.8,16.89 148.08,17.17 ; CN6.1 134.87,22.99 145.41,22.99 145.73,22.67 C26.1 145.73,17.97 146.53,17.17 148.08,17.17 ; 148.08,17.17 148.48,17.17 148.65,17.01 U29.9
$3N6284: length 9.3
  Top Layer w0.4: U29.19 141.62,12.46 140.59,11.43 140.59,9.27 140.31,8.99 139.91,8.99 139.88,9.02 CN6.14
$3N6302: length 11.4
  Top Layer w0.4: U29.18 140.87,13.11 139.7,11.94 139.7,10.8 139.42,10.51 137.13,10.51 136.91,10.29 134.87,10.29 CN6.13
$3N6308: length 7.9
  Top Layer w0.4: CN6.12 136.3,11.4 138.15,11.4 138.43,11.68 138.43,12.19 140,13.76 U29.17
$3N6317: length 10.6
  Top Layer w0.4: CN6.11 134.08,12.04 134.08,12.54 134.37,12.83 137.29,12.83 138.87,14.41 U29.16
$3N6324: length 8.7
  Top Layer w0.4: U29.14 139.49,15.71 137.54,17.65 137.54,18.92 137.26,19.21 136.17,19.21 CN6.6
$3N6338: length 12.7
  Top Layer w0.4: CN6.5 133.96,19.53 133.96,20.07 134.34,20.45 138.05,20.45 138.43,20.07 138.43,18.29 140.36,16.36 U29.13
$3N6346: length 10.6
  Top Layer w0.4: U29.12 141.1,17.01 140.21,17.9 140.21,21.46 139.93,21.75 136.17,21.75 CN6.4
$3N6493: length 77.1
  Top Layer w0.4: CN5.1 154.77,18.62 151.38,15.24 ; CN5.1 154.13,20.32 C26.2 147.13,23.94 146.81,24.26 CN6.2 ; CN5.1 156.13,18.92 159.32,18.92 ; 159.32,18.92 159.39,18.86 R37.2 ; 159.32,18.92 161.29,18.92 161.57,18.64 161.57,14.61 ; U29.4 151.16,13.76 151.38,13.98 ; 151.38,13.98 151.38,13.34 151.16,13.11 U29.3 ; 151.38,13.98 151.38,15.24 ; 161.57,14.61 159.65,14.61 R38.2 ; 161.57,14.61 161.57,10.44 160.91,9.78 142.24,9.78 141.86,10.16 141.86,10.98 U29.20 ; 151.38,15.24 151.2,15.06 U29.6
$1N21: length 6.5
  Top Layer w0.5: U13.1 45.09,49.15 45.34,49.4 C11.1

## Copper pours and planes (outline as drawn; the poured copper is in the pictures)
GND on Bottom Layer: 9.4,58.04 112.78,58.04 112.78,3.94 40.51,3.94 40.51,44.32 9.4,44.32

## Text on the board
Top Silkscreen Layer: SCL | SDA | +5V | GND | RST | SCK | MOSI | MISO | ON=PULL UP | ON=120 Ω | DT | RX | TX | Vcc | SENS1 | SENS2 | B | A | DC / 18V-36V | | | PWR | 1+2=dbg / 2+3=wrk | 1       2       3 | sc=isp | UICD project / ЦЕНТР ИКТ / 2025 / SN_XXXX
